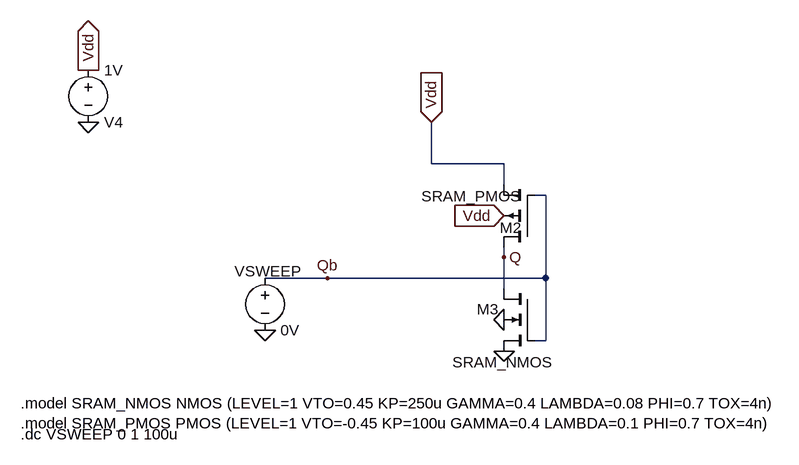
[diagram p0: schematic SNM_HOLD_QBSWEEP.asc]
SNM_HOLD_QBSWEEP.asc, the LTspice schematic file:
Version 4.1
SHEET 1 880 680
WIRE 208 48 208 -16
WIRE 320 48 208 48
WIRE 320 80 320 48
WIRE 384 96 368 96
WIRE 320 192 320 176
WIRE 48 224 -48 224
WIRE 384 224 384 96
WIRE 384 224 48 224
WIRE 320 240 320 192
WIRE 384 320 384 224
WIRE 384 320 368 320
FLAG 320 336 0
FLAG 320 288 0
FLAG 320 128 Vdd
IOPIN 320 128 In
FLAG -320 -16 0
FLAG -320 -96 Vdd
IOPIN -320 -96 Out
FLAG 208 -16 Vdd
IOPIN 208 -16 In
FLAG -48 304 0
FLAG 48 224 Qb
FLAG 320 192 Q
SYMBOL pmos4 368 176 R180
WINDOW 0 21 30 Left 2
WINDOW 3 22 78 Left 2
SYMATTR InstName M2
SYMATTR Value SRAM_PMOS
SYMATTR Value2 l=180nm w=360nm
SYMBOL nmos4 368 240 M0
WINDOW 3 -27 113 Left 2
SYMATTR Value SRAM_NMOS
SYMATTR InstName M3
SYMATTR Value2 l=180nm w=720nm
SYMBOL voltage -320 -112 R0
WINDOW 0 24 96 Left 2
WINDOW 3 24 16 Left 2
WINDOW 123 0 0 Left 0
WINDOW 39 0 0 Left 0
SYMATTR InstName V4
SYMATTR Value 1V
SYMBOL voltage -48 208 R0
WINDOW 0 -47 5 Left 2
WINDOW 123 0 0 Left 0
WINDOW 39 0 0 Left 0
SYMATTR InstName VSWEEP
SYMATTR Value 0V
TEXT -424 416 Left 2 !.model SRAM_NMOS NMOS (LEVEL=1 VTO=0.45 KP=250u GAMMA=0.4 LAMBDA=0.08 PHI=0.7 TOX=4n)\n.model SRAM_PMOS PMOS (LEVEL=1 VTO=-0.45 KP=100u GAMMA=0.4 LAMBDA=0.1 PHI=0.7 TOX=4n)
TEXT -424 464 Left 2 !.dc VSWEEP 0 1 100u

The netlist it stands for:
* SNM_HOLD_QBSWEEP.asc
M2 Q Qb Vdd Vdd SRAM_PMOS l=180nm w=360nm
M3 Q Qb 0 0 SRAM_NMOS l=180nm w=720nm
V4 Vdd 0 1V
VSWEEP Qb 0 0V
.model NMOS NMOS
.model PMOS PMOS
.lib standard.mos
.model SRAM_NMOS NMOS (LEVEL=1 VTO=0.45 KP=250u GAMMA=0.4 LAMBDA=0.08 PHI=0.7 TOX=4n)
.model SRAM_PMOS PMOS (LEVEL=1 VTO=-0.45 KP=100u GAMMA=0.4 LAMBDA=0.1 PHI=0.7 TOX=4n)
.dc VSWEEP 0 1 100u
.backanno
.end